# Altium schematic sheet 12_Power.SchDoc: Power
size A3; Organization: Lime Microsystems; Address1: Surrey Tech Centre; Address2: Guildford GU2 7YG; Address3: Surrey; Address4: United Kingdom; Revision: v1.0; SheetNumber: 12; SheetTotal: 12
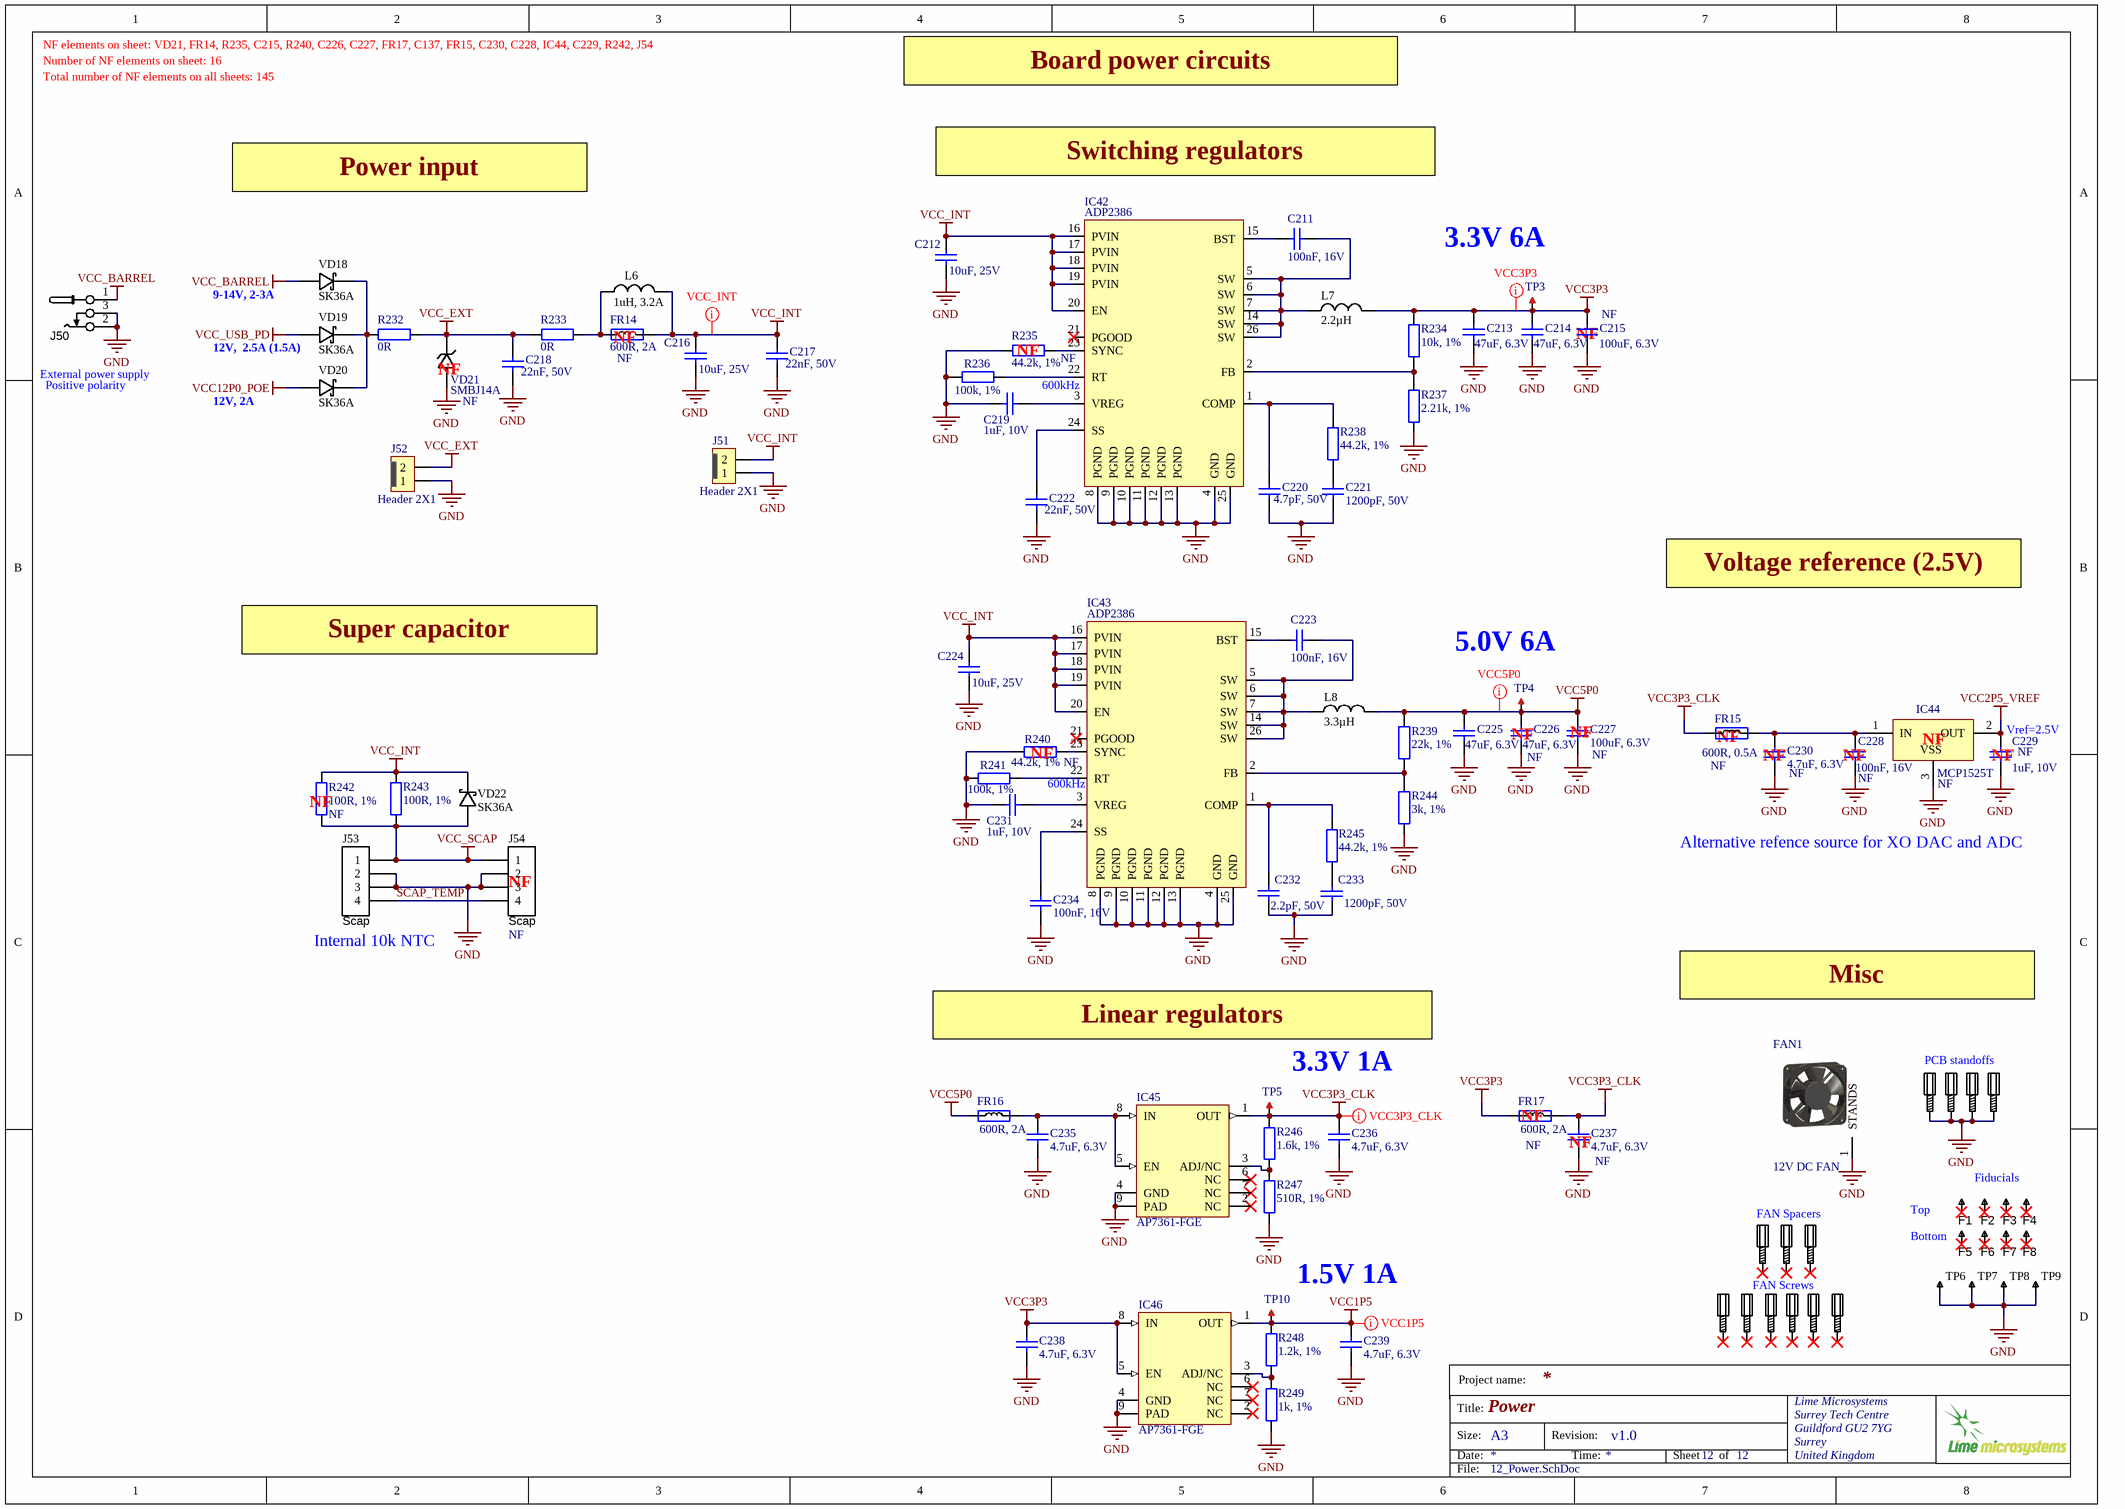
[diagram p0: 12_Power.SchDoc]

## Parts
C211  100nF, 16V  [CAP0402]
C212  10uF, 25V  [CAP0805]
C213  47uF, 6.3V  [CAP1206]
C214  47uF, 6.3V  [CAP1206]
C215  100uF, 6.3V  Assembly Info: NF  [CAP1206]
C216  10uF, 25V  [CAP0805]
C217  22nF, 50V  [CAP0402]
C218  22nF, 50V  [CAP0402]
C219  1uF, 10V  [CAP0402]
C220  4.7pF, 50V  [CAP0402]
C221  1200pF, 50V  [CAP0402]
C222  22nF, 50V  [CAP0402]
C223  100nF, 16V  [CAP0402]
C224  10uF, 25V  [CAP0805]
C225  47uF, 6.3V  [CAP1206]
C226  47uF, 6.3V  Assembly Info: NF  [CAP1206]
C227  100uF, 6.3V  Assembly Info: NF  [CAP1206]
C228  100nF, 16V  Assembly Info: NF  [CAP0402]
C229  1uF, 10V  Assembly Info: NF  [CAP0402]
C230  4.7uF, 6.3V  Assembly Info: NF  [CAP0402]
C231  1uF, 10V  [CAP0402]
C232  2.2pF, 50V  [CAP0402]
C233  1200pF, 50V  [CAP0402]
C234  100nF, 16V  [CAP0402]
C235  4.7uF, 6.3V  [CAP0402]
C236  4.7uF, 6.3V  [CAP0402]
C237  4.7uF, 6.3V  Assembly Info: NF  [CAP0402]
C238  4.7uF, 6.3V  [CAP0402]
C239  4.7uF, 6.3V  [CAP0402]
F1  Fiducial  [Fiducial]  (value not drawn)
F2  Fiducial  [Fiducial]  (value not drawn)
F3  Fiducial  [Fiducial]  (value not drawn)
F4  Fiducial  [Fiducial]  (value not drawn)
F5  Fiducial  [Fiducial]  (value not drawn)
F6  Fiducial  [Fiducial]  (value not drawn)
F7  Fiducial  [Fiducial]  (value not drawn)
F8  Fiducial  [Fiducial]  (value not drawn)
FAN1  12V DC FAN  [FAN_80mm_V1]
FR14  600R, 2A  Assembly Info: NF  [RES0805]
FR15  600R, 0.5A  Assembly Info: NF  [RES0402]
FR16  600R, 2A  [RES0805]
FR17  600R, 2A  Assembly Info: NF  [RES0805]
IC42  ADP2386  [ADP2386]
IC43  ADP2386  [ADP2386]
IC44  MCP1525T  Assembly Info: NF  [SOT23-3_v2]
IC45  AP7361-FGE  [AP7361]
IC46  AP7361-FGE  [AP7361]
J50  CONN_PWR_JACK_2.1x5.5mm  [CONN_PWR_JACK_v2]  (value not drawn)
J51  Header 2X1  [Header1x2_TH_LOCKING]
J52  Header 2X1  [Header1x2_TH_LOCKING]
J53  Scap  [874370443_1P5_SMD_HEADER]
J54  Scap  Assembly Info: NF  [HEADER4X1_TH]
L6  1uH, 3.2A  [NRS4018T3R3MDGJ_inductor]
L7  2.2µH  [FDVE1040_TOKO_INDUCTOR]
L8  3.3µH  [FDVE1040_TOKO_INDUCTOR]
MECH15  # pcs.  [PCB_standoff]  (value not drawn)
MECH16  # pcs.  [PCB_standoff]  (value not drawn)
MECH17  # pcs.  [PCB_standoff]  (value not drawn)
MECH18  # pcs.  [PCB_standoff]  (value not drawn)
MECH19  Spacer M3  (value not drawn)  (mechanical)
MECH20  Spacer M3  (value not drawn)  (mechanical)
MECH21  Spacer M3  (value not drawn)  (mechanical)
MECH22  Screws M3  (value not drawn)  (mechanical)
MECH23  Screws M3  (value not drawn)  (mechanical)
MECH24  Screws M3  (value not drawn)  (mechanical)
MECH25  Screws M3  (value not drawn)  (mechanical)
MECH26  Screws M3  (value not drawn)  (mechanical)
MECH27  Screws M3  (value not drawn)  (mechanical)
R232  0R  [RES0805]
R233  0R  [RES0805]
R234  10k, 1%  [RES0402]
R235  44.2k, 1%  Assembly Info: NF  [RES0402]
R236  100k, 1%  [RES0402]
R237  2.21k, 1%  [RES0402]
R238  44.2k, 1%  [RES0402]
R239  22k, 1%  [RES0402]
R240  44.2k, 1%  Assembly Info: NF  [RES0402]
R241  100k, 1%  [RES0402]
R242  100R, 1%  Assembly Info: NF  [RES0805]
R243  100R, 1%  [RES0805]
R244  3k, 1%  [RES0402]
R245  44.2k, 1%  [RES0402]
R246  1.6k, 1%  [RES0402]
R247  510R, 1%  [RES0402]
R248  1.2k, 1%  [RES0402]
R249  1k, 1%  [RES0402]
TP3  TESTPOINT_PAD  [TP_PAD_1p5MM]  (value not drawn)  (no BOM)
TP4  TESTPOINT_PAD  [TP_PAD_1p5MM]  (value not drawn)  (no BOM)
TP5  TESTPOINT_PAD  [TP_PAD_1p5MM]  (value not drawn)  (no BOM)
TP6  TESTPOINT_THT_MINI  [TP-SMD-LOW_PROFILE]  (value not drawn)
TP7  TESTPOINT_THT_MINI  [TP-SMD-LOW_PROFILE]  (value not drawn)
TP8  TESTPOINT_THT_MINI  [TP-SMD-LOW_PROFILE]  (value not drawn)
TP9  TESTPOINT_THT_MINI  [TP-SMD-LOW_PROFILE]  (value not drawn)
TP10  TESTPOINT_PAD  [TP_PAD_1p5MM]  (value not drawn)  (no BOM)
VD18  SK36A  [SK32A-L_DIODE_DO-214AC]
VD19  SK36A  [SK32A-L_DIODE_DO-214AC]
VD20  SK36A  [SK32A-L_DIODE_DO-214AC]
VD21  SMBJ14A  Assembly Info: NF  [SMAJ12CA-13-F]
VD22  SK36A  [SK32A-L_DIODE_DO-214AC]

## Nets
GND: C212.1 C213.1 C214.1 C215.1 C216.1 C217.2 C218.2 C219.2 C220.2 C221.2 C222.2 C224.1 C225.1 C226.1 C227.1 C228.2 C229.1 C230.1 C231.2 C232.2 C233.2 C234.1 C235.1 C236.1 C237.1 C238.1 C239.1 FAN1.1(STANDS) IC42.4(GND) IC42.8(PGND) IC42.9(PGND) IC42.10(PGND) IC42.11(PGND) IC42.12(PGND) IC42.13(PGND) IC42.25(GND) IC43.4(GND) IC43.8(PGND) IC43.9(PGND) IC43.10(PGND) IC43.11(PGND) IC43.12(PGND) IC43.13(PGND) IC43.25(GND) IC44.3(VSS) IC45.4(GND) IC45.9(PAD) IC46.4(GND) IC46.9(PAD) J50.2 J50.3 J51.1 J52.1 J53.2 J53.3 J54.2 J54.3 MECH15.MH1 MECH16.MH1 MECH17.MH1 MECH18.MH1 R235.2 R236.2 R237.1 R240.2 R241.2 R244.1 R247.2 R249.1 TP6.1 TP7.1 TP8.1 TP9.1 VD21.A
VCC1P5: C239.2 IC46.1(OUT) R248.1 TP10.1
VCC2P5_VREF: C229.2 IC44.2(OUT)
VCC3P3: C213.2 C214.2 C215.2 C238.2 FR17.1 IC46.5(EN) IC46.8(IN) L7.2 R234.1 TP3.1
VCC3P3_CLK: C236.2 C237.2 FR15.1 FR17.2 IC45.1(OUT) R246.2 TP5.1
VCC5P0: C225.2 C226.2 C227.2 FR16.1 L8.2 R239.2 TP4.1
VCC12P0_POE: VD20.A
VCC_BARREL: J50.1 VD18.A
VCC_EXT: C218.1 J52.2 R232.1 R233.2 VD21.K
VCC_INT: C212.2 C216.2 C217.1 C224.2 FR14.2 IC42.16(PVIN) IC42.17(PVIN) IC42.18(PVIN) IC42.19(PVIN) IC42.20(EN) IC43.16(PVIN) IC43.17(PVIN) IC43.18(PVIN) IC43.19(PVIN) IC43.20(EN) J51.2 L6.2 R242.1 R243.1 VD22.K
VCC_SCAP: J53.1 J54.1 R242.2 R243.2 VD22.A
VCC_USB_PD: VD19.A
SCAP_TEMP: J53.4 J54.4
NetC211_1: C211.1 IC42.15(BST)
NetC211_2: C211.2 IC42.5(SW) IC42.6(SW) IC42.7(SW) IC42.14(SW) IC42.26(SW) L7.1
NetC219_1: C219.1 IC42.3(VREG)
NetC220_1: C220.1 IC42.1(COMP) R238.2
NetC221_1: C221.1 R238.1
NetC222_1: C222.1 IC42.24(SS)
NetC223_1: C223.1 IC43.15(BST)
NetC223_2: C223.2 IC43.5(SW) IC43.6(SW) IC43.7(SW) IC43.14(SW) IC43.26(SW) L8.1
NetC228_1: C228.1 C230.2 FR15.2 IC44.1(IN)
NetC231_1: C231.1 IC43.3(VREG)
NetC232_1: C232.1 IC43.1(COMP) R245.2
NetC233_1: C233.1 R245.1
NetC234_2: C234.2 IC43.24(SS)
NetC235_2: C235.2 FR16.2 IC45.5(EN) IC45.8(IN)
NetFR14_1: FR14.1 L6.1 R233.1
NetIC42_2: IC42.2(FB) R234.2 R237.2
NetIC42_22: IC42.22(RT) R236.1
NetIC42_23: IC42.23(SYNC) R235.1
NetIC43_2: IC43.2(FB) R239.1 R244.2
NetIC43_22: IC43.22(RT) R241.1
NetIC43_23: IC43.23(SYNC) R240.1
NetIC45_3: IC45.3(ADJ/NC) R246.1 R247.1
NetIC46_3: IC46.3(ADJ/NC) R248.2 R249.2
NetR232_2: R232.2 VD18.K VD19.K VD20.K

Not connected (* = marked no-connect by the designer): F1 1*; F2 1*; F3 1*; F4 1*; F5 1*; F6 1*; F7 1*; F8 1*; IC42 21(PGOOD)*; IC43 21(PGOOD)*; IC45 2(NC)* 6(NC)* 7(NC)*; IC46 2(NC)* 6(NC)* 7(NC)*; MECH19 MH1*; MECH20 MH1*; MECH21 MH1*; MECH22 MH1*; MECH23 MH1*; MECH24 MH1*; MECH25 MH1*; MECH26 MH1*; MECH27 MH1*

## Layout directives
net class VCC1P4_LMS: VCC1P5
net class VCC3P3_CLK: VCC3P3_CLK
net class VCC3P3: VCC3P3
net class VCC_INT: VCC_INT
net class VCC5P0: VCC5P0

## Notes on the sheet
- NF elements on sheet: VD21, FR14, R235, C215, R240, C226, C227, FR17, C137, FR15, C230, C228, IC44, C229, R242, J54
- Number of NF elements on sheet: 16
- Total number of NF elements on all sheets: 145
- Board power circuits
- Switching regulators
- Power input
- (near TP3) 3.3V 6A
- 9-14V, 2-3A
- (near J50) External power supply
- (near VD19) 12V,  2.5A (1.5A)
- (near VD21) NF
- (near FR14) NF
- (near R235) NF
- (near C215) NF
- (near J50) Positive polarity
- 12V, 2A
- (near IC42) 600kHz
- Voltage reference (2.5V)
- Super capacitor
- (near TP4) 5.0V 6A
- (near R240) NF
- (near IC43) 600kHz
- (near C226) NF
- (near C227) NF
- (near FR15) NF
- (near C230) NF
- (near C228) NF
- (near IC44) NF
- (near C229) NF
- (near C229) Vref=2.5V
- (near R242) NF
- Alternative refence source for XO DAC and ADC
- (near J54) NF
- (near J53) Internal 10k NTC
- Linear regulators
- Misc
- 3.3V 1A
- (near FR17) NF
- PCB standoffs
- (near C237) NF
- Fiducials
- FAN Spacers
- Top
- (near F5) Bottom
- 1.5V 1A
- FAN Screws
- Project name:
- Title:
- Size:
- Date:
- A3
- Revision:
- Time:
- Sheet
- of
- File:

## Library data of the parts
C211 C223 C234 = Cap_0402: Manufacturer: Murata Electronics; Manufacturer Part Number 1: GRM155R71C104KA88D; Part Description: 0.10µF ±10% 16V Ceramic Capacitor X7R 0402 (1005 Metric); Tolerance: 10 %; Type: General Purpose MLCC; Capacitance: 0.1 uF; Case Length: 1 mm; Dielectric: X7R; Case Height: 0.5 mm; Temperature Coefficient / Code: +/- 15 %; Value: 100nF, 16V; Supplier 1: Mouser; Supplier Part Number 1: 81-GRM155R71C104KA88; Case Code - in: 0402; RoHS: RoHS Compliant; Operating Temperature Range: - 55 C to + 125 C; Series: GRM; Termination Style: SMD/SMT; Package / Case: 0402 (1005 metric); Voltage Rating DC: 16 V; Maximum Operating Temperature: + 125 C; Case Code - mm: 1005; Minimum Operating Temperature: - 55 C; Product Category: Low & Medium Capacitance SMD Ceramic Chip Capacitors; Packaging: Reel; Product: General Type MLCCs; Category: Multilayer Ceramic Capacitors MLCC - SMD/SMT; Brand: Murata Electronics; Case Width: 0.5 mm; RoHS - Mouser: Y; Standard Pack Qty: 10000; Minimum Order Quantity: 1; Reeling: True; Manufacturer Part Number: GRM155R71C104KA88D
C212 C216 C224 = Cap_0603: Manufacturer: Murata Electronics North America; Manufacturer Part Number: GRM188R61E106MA73D; Part Description: 10µF ±20% 25V X5R Ceramic Capacitor -55°C ~ 85°C Surface Mount, MLCC 0603 (1608 Metric) 0.063" L x 0.031" W (1.60mm x 0.80mm); Capacitance: 10µF; Tolerance: ±20%; Temperature Coefficient: X5R; Supplier 1: Digi-Key; Supplier Part Number 1: 490-7202-2-ND; Category: Capacitors; RoHS: RoHS Compliant; Packaging: Tape & Reel (TR); Voltage - Rated: 25V; Mounting Type: Surface Mount, MLCC; Operating Temperature: -55°C ~ 85°C; Applications: General Purpose; Ratings: -; Package / Case: 0603 (1608 Metric); Size / Dimension: 0.063" L x 0.031" W (1.60mm x 0.80mm); Height - Seated (Max): -; Thickness (Max): 0.031" (0.80mm); Lead Spacing: -; Features: -; Lead Style: -; value: 10uF, 25V; Manufacturer Part Number 1: GRM188R61E106MA73D
C213 C214 C225 C226 = Cap_1206: Manufacturer: Samsung Electro-Mechanics; Manufacturer Part Number: CL31A476MQHNNNE; Part Description: 47µF ±20% 6.3V Ceramic Capacitor X5R 1206 (3216 Metric); Notification: Current market demand for these product types have resulted in fluctuating and extending lead times. Lead times may differ.; Temperature Coefficient: X5R; Tolerance: ±20%; Thickness (Max): 0.071" (1.80mm); Height - Seated (Max): -; Operating Temperature: -55°C ~ 85°C; Lead Style: -; Package / Case: 1206 (3216 Metric); Size / Dimension: 0.126" L x 0.063" W (3.20mm x 1.60mm); Applications: General Purpose; Ratings: -; Mounting Type: Surface Mount, MLCC; Voltage - Rated: 6.3V; Lead Spacing: -; Features: -; Supplier Part Number 1: 1276-1167-1-ND; RoHS: RoHS Compliant; Category: Capacitors; Supplier 1: Digi-Key; Packaging: Cut Tape (CT); Part Status: Active; Value: 47uF, 6.3V; Manufacturer Part Number 1: CL31A476MQHNNNE
C215 C227 = Cap_1206: Manufacturer: MURATA; Manufacturer Part Number 1: GRM31CR60J107ME39L.; Part Description: SMD Multilayer Ceramic Capacitor, 1206 [3216 Metric], 100 µF, 6.3 V, ± 20%, X5R, GRM Series; Capacitance Tolerance: ± 20%; Ceramic Capacitor Case: 1206 [3216 Metric]; Voltage Rating: 6.3; value: 100uF, 6.3V; Supplier Part Number 1: 1735535; Supplier 1: Farnell
C217 C218 C222 = Cap_0402: Manufacturer: Kemet; Manufacturer Part Number 1: C0402C223K5RACTU; Part Description: 0.022µF ±10% 50V X7R Ceramic Capacitor -55°C ~ 125°C Surface Mount, MLCC 0402 (1005 Metric) 0.039" L x 0.020" W (1.00mm x 0.50mm); Temperature Coefficient: X7R; Tolerance: ±10%; Capacitance: 0.022µF; Value: 22nF, 50V; Supplier 1: Digi-Key; Supplier Part Number 1: 399-7780-1-ND; Ratings: -; Packaging: Cut Tape (CT); Category: Capacitors; Size / Dimension: 0.039" L x 0.020" W (1.00mm x 0.50mm); RoHS: RoHS Compliant; Operating Temperature: -55°C ~ 125°C; Mounting Type: Surface Mount, MLCC; Applications: General Purpose; Voltage - Rated: 50V; Thickness (Max): 0.022" (0.55mm); Features: -; Height - Seated (Max): -; Lead Style: -; Package / Case: 0402 (1005 Metric); Lead Spacing: -
C219 C229 C231 = Cap_0402: Manufacturer Part Number 1: CC0402MRX5R6BB105; Manufacturer: Yageo; Part Description: 1µF 10V Ceramic Capacitor X5R 0402 (1005 Metric) 0.039" L x 0.020" W (1.00mm x 0.50mm); Voltage Rating: 10; Capacitance Tolerance: ± 10%; Product Range: TDK - C Series; Ceramic Capacitor Case: 0402 [1005 Metric]; Capacitance: 1; Dielectric Characteristic: X6; Value: 1uF, 10V; Supplier 1: Digi-Key; Supplier Part Number 1: 311-1732-1-ND; MSL: -; RoHS: YES
C220 = Cap_0402: Manufacturer Part Number 1: GRM1555C1H4R7CA01D; Part Description: 4.7pF ±0.25pF 50V C0G, NP0 Ceramic Capacitor -55°C ~ 125°C Surface Mount, MLCC 0402 (1005 Metric) 0.039" L x 0.020" W (1.00mm x 0.50mm); Manufacturer: Murata Electronics North America; Capacitance Tolerance: ± 0.25; Voltage Rating: 50; Dielectric Characteristic: C0G / NP0; Ceramic Capacitor Case: 0402 [1005 Metric]; Capacitance: 4.7; SVHC: No SVHC (15-Jun-2015; Product Range: GRM Series; Value: 4.7pF, 50V; Supplier 1: Farnell; Supplier Part Number 1: 2434644; Operating Temperature Max: 125; Operating Temperature Min: -55; MSL: MSL 1 - Unlimited; RoHS: YES; Packaging: Cut Tape
C221 = Cap_0402: Manufacturer: Kemet; Manufacturer Part Number 1: C0402C122J5GACTU; Part Description: 1200pF ±5% 50V C0G, NP0 Ceramic Capacitor -55°C ~ 125°C Surface Mount, MLCC 0402 (1005 Metric) 0.039" L x 0.020" W (1.00mm x 0.50mm); Temperature Coefficient: C0G, NP0; Tolerance: ±5%; Value: 1200pF, 50V; Supplier 1: Digi-Key; Supplier Part Number 1: 399-7334-1-ND; Thickness (Max): 0.022" (0.55mm); Capacitance: 1200pF; Lead Spacing: -; Mounting Type: Surface Mount, MLCC; Package / Case: 0402 (1005 Metric); Category: Capacitors; Size / Dimension: 0.039" L x 0.020" W (1.00mm x 0.50mm); Voltage - Rated: 50V; Lead Style: -; Ratings: -; Features: -; Packaging: Cut Tape (CT); RoHS: RoHS Compliant; Operating Temperature: -55°C ~ 125°C; Applications: General Purpose; Height - Seated (Max): -
C228 = Cap_0603: Manufacturer Part Number 1: GRM155R71C104KA88D; Part Description: 0.10µF ±10% 16V Ceramic Capacitor X7R 0402 (1005 Metric); Brand: Murata Electronics; Tolerance: 10 %; Type: General Purpose MLCC; Capacitance: 0.1 uF; Temperature Coefficient / Code: +/- 15 %; Case Height: 0.5 mm; Case Length: 1 mm; Dielectric: X7R; Supplier 1: Mouser; Supplier Part Number 1: 81-GRM155R71C104KA88; Case Code - in: 0402; Manufacturer: Murata Electronics; Category: Multilayer Ceramic Capacitors MLCC - SMD/SMT; Voltage Rating DC: 16 V; Value: 100nF, 16V; Case Code - mm: 1005; Case Width: 0.5 mm; Maximum Operating Temperature: + 125 C; Minimum Operating Temperature: - 55 C; Minimum Order Quantity: 1; Operating Temperature Range: - 55 C to + 125 C; Package / Case: 0402 (1005 metric); Packaging: Reel; Product: General Type MLCCs; Product Category: Low & Medium Capacitance SMD Ceramic Chip Capacitors; Reeling: True; RoHS - Mouser: Y; RoHS: RoHS Compliant; Series: GRM; Standard Pack Qty: 10000; Termination Style: SMD/SMT; Manufacturer Part Number: GRM155R71C104KA88D
C230 C235-C239 = Cap_0402: Manufacturer: Murata Electronics North America; Manufacturer Part Number 1: GRM155R60J475ME87D; Part Description: 4.7µF ±20% 6.3V X5R Ceramic Capacitor -55°C ~ 85°C Surface Mount, MLCC 0402 (1005 Metric) 0.039" L x 0.020" W (1.00mm x 0.50mm); Tolerance: ±20%; Capacitance: 4.7µF; Temperature Coefficient: X5R; Lead Style: -; Ratings: -; Height - Seated (Max): -; Thickness (Max): 0.022" (0.55mm); Voltage - Rated: 6.3V; Packaging: Cut Tape (CT); Lead Spacing: -; Category: Capacitors; Supplier Part Number 1: 490-5408-1-ND; Applications: General Purpose; Operating Temperature: -55°C ~ 85°C; Mounting Type: Surface Mount, MLCC; Features: Derating Recommended; RoHS: RoHS Compliant; Supplier 1: Digi-Key; Package / Case: 0402 (1005 Metric); Size / Dimension: 0.039" L x 0.020" W (1.00mm x 0.50mm); Value: 4.7uF, 6.3V
C232 = Cap_0402: Manufacturer Part Number 1: CL05C2R2CB5NNNC; Manufacturer: Samsung Electro-Mechanics America, Inc.; Part Description: 2.2pF ±0.25pF 50V Ceramic Capacitor C0G, NP0 0402 (1005 Metric); Temperature Coefficient: C0G, NP0; Tolerance: ±0.25pF; Value: 2.2pF, 50V; Lead Spacing: -; Applications: General Purpose; Supplier 1: Digi-Key; Thickness (Max): 0.022" (0.55mm); Operating Temperature: -55°C ~ 125°C; Size / Dimension: 0.039" L x 0.020" W (1.00mm x 0.50mm); Mounting Type: Surface Mount, MLCC; Features: -; Voltage - Rated: 50V; Capacitance: 2.2pF; Lead Style: -; Supplier Part Number 1: 1276-1271-1-ND; Height - Seated (Max): -; Package / Case: 0402 (1005 Metric); Category: Capacitors; Packaging: Cut Tape (CT); Ratings: -; RoHS: RoHS Compliant
C233 = Cap_0402: Manufacturer: Kemet; Manufacturer Part Number 1: C0402C122J5GACTU; Part Description: 1200pF ±5% 50V Ceramic Capacitor C0G, NP0 0402 (1005 Metric); Temperature Coefficient: C0G, NP0; Tolerance: ±5%; Value: 1200pF, 50V; Supplier 1: Digi-Key; Supplier Part Number 1: 399-7334-1-ND; Thickness (Max): 0.022" (0.55mm); Capacitance: 1200pF; Lead Spacing: -; Mounting Type: Surface Mount, MLCC; Package / Case: 0402 (1005 Metric); Category: Capacitors; Size / Dimension: 0.039" L x 0.020" W (1.00mm x 0.50mm); Voltage - Rated: 50V; Lead Style: -; Ratings: -; Features: -; Packaging: Cut Tape (CT); RoHS: RoHS Compliant; Operating Temperature: -55°C ~ 125°C; Applications: General Purpose; Height - Seated (Max): -
FAN1 = 12V_DC_FAN: Part Description: Fan Tubeaxial 12VDC Square - 80mm L x 80mm H Vapo-Bearing™ 37.0 CFM (1.04m³/min) 2 Wire Leads; Manufacturer: Sunon; Manufacturer Part Number 1: ME80151V1-000U-A99; Airflow: 37CFM; Noise: 34.7dBA; Max Power Dissipation: 1.96W; RPM: 3000RPM; Bearing Type: Vapo-Bearing; Current Rating: 163mA; Approvals: UL,CE,TUV; Supplier 1: Digi-Key; Supplier Part Number 1: 259-1649-ND; Stock 1: 1611; Pricing 1: 1=6,90000, 10=6,66700, 25=6,47400, 50=6,08860, 100=5,47200, 250=5,39488, 500=5,04808 (USD); RoHS: Yes; Case/Package: Axial; Housing Material: Thermoplastic; Weight: 0.15lb; Min Operating Temperature: 14°C; Max Operating Temperature: 158°C; Termination: 2 Wire Leads; Package Quantity: 30; Width: 15mm; Flammability Rating: UL94 V-0; ComponentLink1URL: https://datasheet.ciiva.com/18514/me8015-u-18514537.pdf?src-supplier=Digi-Key; ComponentLink1Description: https://datasheet.ciiva.com/18514/me8015-u-18514537.pdf?src-supplier=Digi-Key
FR14 = Ferrite: Manufacturer Part Number 1: MPZ2012S601AT000; Manufacturer: TDK Corporation; Part Description: FERRITE BEAD 600 OHM 0805 1LN; DC Resistance (DCR): 100 mOhm Max; Filter Type: Differential Mode - Single; Impedance @ Frequency: 600 Ohm @ 100MHz; Supplier 1: Digi-Key; Supplier Part Number 1: 445-2206-2-ND; Value: 600R, 2A; Category: Filters; Current Rating: 2A; Height (Max): 0.041" (1.05mm); Mounting Type: Surface Mount; Package / Case: 0805 (2012 Metric); Packaging: Tape & Reel (TR); RoHS: RoHS Compliant; Size / Dimension: 0.079" L x 0.049" W (2.00mm x 1.25mm)
FR15 = Ferrite: Manufacturer: Murata; Manufacturer Part Number 1: BLM15AX601SN1D; Part Description: - Ferrite Bead 0402 (1005 Metric) 500mA 340mOhm; Tolerance: 25%; Current Rating: 500mA; Number of Lines: 1; DC Resistance (DCR): 340mR; Test Frequency: 100MHz; Value: 600R, 0.5A; Supplier 1: Digi-Key; Supplier Part Number 1: 490-5441-1-ND; Stock 1: 416370; Pricing 1: 1=0.1, 10=0.06, 25=0.0552, 50=0.0496, 100=0.0363, 250=0.0264, 500=0.0242, 1000=0.0209, 5000=0.0165 (USD); Case/Package: 0402; Number of Pins: 2; Case Code (Metric): 1005; Case Code (Imperial): 0402; Core Material: Ferrite; Material: Steel,Ferrite; Min Operating Temperature: -55°C; Max Operating Temperature: 125°C; Package Quantity: 1; Packaging: Tape and Reel; Series: BLM15AX_SN; Impedance: 600R; Max Current Rating: 500mA; Termination: SMD/SMT; Max DC Current: 500mA; Number of Circuits: 1; DC Resistance-Max: 340mR; Length: 1mm; Width: 0.5mm; Height: 0.5mm; Depth: 0.5mm; REACH SVHC: No SVHC; Lead Free: Lead Free; RoHS Compliant: Yes; ComponentLink1URL: https://www.murata.com/en-us/products/productdata/8796740059166/ENFA0018.pdf?src-supplier=Digi-Key; ComponentLink1Description: https://www.murata.com/en-us/products/productdata/8796740059166/ENFA0018.pdf?src-supplier=Digi-Key; ComponentLink2URL: http://search.murata.co.jp/Ceramy/image/img/PDF/ENG/L0110S0100BLM15AX_SN.pdf?src-supplier=Future+Electronics; ComponentLink2Description: http://search.murata.co.jp/Ceramy/image/img/PDF/ENG/L0110S0100BLM15AX_SN.pdf?src-supplier=Future+Electronics; ComponentLink3URL: http://www.produktinfo.conrad.com/datenblaetter/1100000-1199999/001171675-da-01-en-CHIP_DROSSEL0402_600R_420MA_1_0X0_5MM.pdf?src-supplier=Conrad; ComponentLink3Description: http://www.produktinfo.conrad.com/datenblaetter/1100000-1199999/001171675-da-01-en-CHIP_DROSSEL0402_600R_420MA_1_0X0_5MM.pdf?src-supplier=Conrad; ComponentLink4URL: http://www.produktinfo.conrad.com/datenblaetter/1100000-1199999/001172169-da-01-en-DROSSEL_0402_600R_1_0X0_5MM_10000ST.pdf?src-supplier=Conrad; ComponentLink4Description: http://www.produktinfo.conrad.com/datenblaetter/1100000-1199999/001172169-da-01-en-DROSSEL_0402_600R_1_0X0_5MM_10000ST.pdf?src-supplier=Conrad
FR16 FR17 = Ferrite: Manufacturer Part Number 1: MPZ2012S601AT000; Manufacturer: TDK Corporation; Part Description: FERRITE BEAD 600 OHM 0805 1LN; Filter Type: Differential Mode - Single; Impedance @ Frequency: 600 Ohm @ 100MHz; DC Resistance (DCR): 100 mOhm Max; Supplier 1: Digi-Key; Supplier Part Number 1: 445-2206-2-ND; Mounting Type: Surface Mount; RoHS: RoHS Compliant; Height (Max): 0.041" (1.05mm); Packaging: Tape & Reel (TR); Category: Filters; Current Rating: 2A; Package / Case: 0805 (2012 Metric); Size / Dimension: 0.079" L x 0.049" W (2.00mm x 1.25mm)
IC42 = ADP2386: Manufacturer Part Number: ADP2386ACPZN-R7; Manufacturer: Analog Devices Inc.; Part Description: IC REG BUCK ADJ 6A SYNC 24LFCSP; Function: Step-Down; Voltage - Output (Max): 18V; Synchronous Rectifier: Yes; Output Configuration: Positive; Frequency - Switching: 200kHz ~ 1.4MHz; Number of Outputs: 1; Output Type: Adjustable; Topology: Buck; Voltage - Input (Min): 4.5V; Voltage - Output (Min/Fixed): 0.6V; Voltage - Input (Max): 20V; Current - Output: 6A; Supplier 1: Digi-Key; Packaging: Digi-Reel®; RoHS: RoHS Compliant; Package / Case: 24-WFQFN Exposed Pad, CSP; Operating Temperature: -40°C ~ 125°C (TJ); Supplier Device Package 1: 24-LFCSP-WQ (4x4); Mounting Type: Surface Mount; Category: Integrated Circuits (ICs); Supplier Part Number 1: ADP2386ACPZN-R7DKR-ND; Manufacturer Part Number 1: ADP2386ACPZN-R7
IC43 = ADP2386: Manufacturer: Analog Devices Inc.; Part Description: Buck Switching Regulator IC Positive Adjustable 0.6V 1 Output 6A 24-WFQFN Exposed Pad, CSP; Manufacturer Part Number 1: ADP2386ACPZN-R7; Function: Step-Down; Voltage - Output (Max): 18V; Synchronous Rectifier: Yes; Output Configuration: Positive; Frequency - Switching: 200kHz ~ 1.4MHz; Number of Outputs: 1; Output Type: Adjustable; Topology: Buck; Voltage - Input (Min): 4.5V; Voltage - Output (Min/Fixed): 0.6V; Voltage - Input (Max): 20V; Current - Output: 6A; Supplier 1: Digi-Key; Packaging: Digi-Reel®; RoHS: RoHS Compliant; Package / Case: 24-WFQFN Exposed Pad, CSP; Operating Temperature: -40°C ~ 125°C (TJ); Supplier Device Package: 24-LFCSP-WQ (4x4); Mounting Type: Surface Mount; Category: Integrated Circuits (ICs); Supplier Part Number 1: ADP2386ACPZN-R7DKR-ND
IC44 = MCP1525T-I/TT: 2.5V Voltage Reference, 3-Pin SOT-23, Industrial Temperature, Tape and Reel; Manufacturer: Microchip Technology; Part Description: Series Voltage Reference IC ±1% 2mA SOT-23-3; Reference Type: Series; Output Type: Fixed; Current - Output: 2mA; Tolerance: ±1%; Temperature Coefficient: 50ppm/°C; Noise - 0.1Hz to 10Hz: 90µVp-p; Noise - 10Hz to 10kHz: 500µVrms; Voltage - Input: 2.7 V ~ 5.5 V; Current - Supply: 120µA; PackageDescription: Series Voltage Reference IC ±1% 2mA SOT-23-3; Supplier 1: Digi-Key; Manufacturer Part Number 1: MCP1525T-I/TT; RoHS: RoHS Compliant; Category: Integrated Circuits (ICs); Stock 1: 16612; Pricing 1: 1=0.77, 25=0.64, 100=0.58 (USD); Packaging: Digi-Reel®; Part Status: Active; Voltage - Output (Min/Fixed): 2.5V; Voltage - Output (Max): -; Current - Cathode: -; Operating Temperature: -40°C ~ 85°C (TA); Mounting Type: Surface Mount; Package / Case: TO-236-3, SC-59, SOT-23-3; Supplier Device Package: SOT-23-3; ComponentLink1URL: http://www.microchip.com/mymicrochip/filehandler.aspx?ddocname=en011331; ComponentLink1Description: http://www.microchip.com/mymicrochip/filehandler.aspx?ddocname=en011331; Supplier Part Number 1: MCP1525T-I/TTDKR-ND
IC45 IC46 = AP7361: Manufacturer Part Number 1: AP7361-FGE-7; Manufacturer: Diodes Incorporated; Part Description: IC REG LDO ADJ 1A 8DFN; Regulator Topology: Positive Adjustable; Current - Output: 1A; Current - Limit (Min): 1.1A; Voltage - Dropout (Typical): 0.5V @ 1A; Voltage - Output: 0.8 V ~ 5.5 V; Number of Regulators: 1; Voltage - Input: 2.2 V ~ 6 V; Supplier 1: Digi-Key; Supplier Part Number 1: AP7361-FGE-7DICT-ND; RoHS: RoHS Compliant; Supplier Device Package: U-DFN3030-8; Mounting Type: Surface Mount; Category: Integrated Circuits (ICs); Packaging: Cut Tape (CT); Package / Case: 8-UDFN Exposed Pad; Operating Temperature: -40°C ~ 85°C
J50 = CONN_PWR_JACK_2.1x5.5mm: Power Connector, THT, 2.1mm ID, 5.5mm OD; Part Description: Power Barrel Connector Jack 2.10mm ID (0.083"), 5.50mm OD (0.217") Through Hole, Right Angle; Manufacturer: CUI; Manufacturer Part Number 1: PJ-002A; Gender: Male; Shielding: Unshielded; Current Rating: 2.5A; Connector Type: Jack; Voltage Rating: 24V; Insulation Resistance: 50MR; Number of Conductors: 2; ComponentLink1URL: https://www.verical.com/server-webapp/html/getDatasheet?partID=110865; ComponentLink1Description: https://www.verical.com/server-webapp/html/getDatasheet?partID=110865; ComponentLink2URL: http://www.switchcraft.com/Documents/Jack_Schematics.pdf; ComponentLink2Description: http://www.switchcraft.com/Documents/Jack_Schematics.pdf; Supplier 1: Digi-Key; Supplier Part Number 1: CP-002A-ND; RoHS: Yes; Stock 1: 181439; Pricing 1: 1 = 0,60000, 10 = 0,55800, 25 = 0,50240, 50 = 0,44640, 100 = 0,42780, 250 = 0,39060, 500 = 0,37200, 1000 = 0,30690, 2500 = 0,27900 (USD); Mount: Through Hole; Contact Material: Copper,Copper Alloy; Contact Plating: Nickel,Tin; Housing Color: Black; Housing Material: Thermoplastic; Color: Black; Min Operating Temperature: -25°C; Max Operating Temperature: 85°C; Termination: Through Hole; Packaging: Bulk; Package Quantity: 500; Contact Gender: Male; Orientation: Horizontal; Diameter: 2.1mm; Lead Free: Lead Free; Flammability Rating: UL94 V-0
J51 J52 = Header 2X1 LOCK: Manufacturer 1: Molex; Part Description: Connector Header Through Hole 2 position 0.100" (2.54mm); Supplier 1: Digi-Key; Supplier Part Number 1: WM19460-ND; Manufacturer Part Number: 22-11-2026; Stock 1: 0; RoHS: Yes; ComponentLink1URL: https://datasheet.ciiva.com/5156/022045042-sd-206842-5156139.pdf?src-supplier=Mouser; ComponentLink1Description: https://datasheet.ciiva.com/5156/022045042-sd-206842-5156139.pdf?src-supplier=Mouser; ComponentLink2URL: https://datasheet.ciiva.com/30212/022232051-sd-30212109.pdf?src-supplier=Onlinecomponents.com; ComponentLink2Description: https://datasheet.ciiva.com/30212/022232051-sd-30212109.pdf?src-supplier=Onlinecomponents.com; Manufacturer: Molex; Manufacturer Part Number 1: 22-11-2026
J53 = Header4P: Header, 4-pin; Manufacturer 1: Molex; Manufacturer Part Number: 0874370443; Part Description: Connector Header Surface Mount 4 position 0.059" (1.50mm); ComponentLink1URL: http://katalog.we-online.de/em/datasheet/6130xx11121.pdf; ComponentLink1Description: http://katalog.we-online.de/em/datasheet/6130xx11121.pdf; Supplier 1: Digi-Key; Supplier Part Number 1: WM7664CT-ND; Stock 1: 30818; Pricing 1: 1=0,72000, 10=0,61200, 100=0,47560 (USD); RoHS: Yes; ComponentLink2URL: https://datasheet.ciiva.com/6813/874370443-sd-6813714.pdf?src-supplier=Digi-Key; ComponentLink2Description: https://datasheet.ciiva.com/6813/874370443-sd-6813714.pdf?src-supplier=Digi-Key; ComponentLink3URL: https://datasheet.ciiva.com/3935/197970874370443-pcb-headers-3935892.pdf?src-supplier=Arrow+Electronics; ComponentLink3Description: https://datasheet.ciiva.com/3935/197970874370443-pcb-headers-3935892.pdf?src-supplier=Arrow+Electronics; ComponentLink4URL: https://datasheet.ciiva.com/6813/874370443-sd-6813717.pdf?src-supplier=Digi-Key; ComponentLink4Description: https://datasheet.ciiva.com/6813/874370443-sd-6813717.pdf?src-supplier=Digi-Key; ComponentLink5URL: https://datasheet.ciiva.com/6813/874370443-sd-6813721.pdf?src-supplier=Digi-Key; ComponentLink5Description: https://datasheet.ciiva.com/6813/874370443-sd-6813721.pdf?src-supplier=Digi-Key; Manufacturer: Molex; Manufacturer Part Number 1: 0874370443
J54 = Header4P: Header, 4-pin; Part Description: 4 Positions Header Connector 0.100" (2.54mm) Through Hole Gold; Manufacturer: Wurth Electronics Inc.; Manufacturer Part Number 1: 61300411121; Pitch - Mating: 0.100" (2.54mm); Number of Positions: 4; Number of Positions Loaded: All; Style: Board to Board or Cable; Shrouding: Unshrouded; Contact Length - Mating: 0.236" (6.00mm); Contact Length - Post: 0.118" (3.00mm); Overall Contact Length: 0.454" (11.54mm); Material Flammability Rating: UL94 V-0; Current Rating: 3A; Voltage Rating: 250V; Supplier 1: Digi-Key; Supplier Part Number 1: 732-5317-ND; RoHS: RoHS Compliant; Category: Connectors, Interconnects; Stock 1: 25204; Pricing 1: 1=0.18, 10=0.153, 25=0.1272, 50=0.106, 100=0.096, 1000=0.088 (USD); Packaging: Bulk; Part Status: Active; Connector Type: Header; Contact Type: Male Pin; Number of Rows: 1; Row Spacing - Mating: -; Mounting Type: Through Hole; Termination: Solder; Fastening Type: Push-Pull; Insulation Height: 0.100" (2.54mm); Contact Shape: Square; Contact Finish - Mating: Gold; Contact Finish Thickness - Mating: -; Contact Finish - Post: -; Contact Material: Copper Alloy; Insulation Material: Polybutylene Terephthalate (PBT); Features: -; Operating Temperature: -40°C ~ 125°C; Ingress Protection: -; Insulation Color: Black; Mated Stacking Heights: -; Contact Finish Thickness - Post: -; Applications: -; ComponentLink1URL: http://katalog.we-online.de/em/datasheet/6130xx11121.pdf; ComponentLink1Description: http://katalog.we-online.de/em/datasheet/6130xx11121.pdf
L6 = Inductor_0603: Manufacturer: Taiyo Yuden; Manufacturer Part Number 1: NRS4018T1R0NDGJ; Part Description: 1 µH Shielded Drum Core, Wirewound Inductor 3.2 A 32.4mOhm Max Nonstandard; Core Material: Ferrite; Self Resonant Frequency: 90MHz; Tolerance: 30%; Saturation Current: 4A; Shielding: Shielded; DC Resistance (DCR): 32.4mR; Test Frequency: 100kHz; ComponentLink1URL: https://www.yuden.co.jp/productdata/catalog/en/wound04_e.pdf; ComponentLink1Description: https://www.yuden.co.jp/productdata/catalog/en/wound04_e.pdf; ComponentLink2URL: http://uk.rs-online.com/webdocs/10b3/0900766b810b3cd2.pdf; ComponentLink2Description: http://uk.rs-online.com/webdocs/10b3/0900766b810b3cd2.pdf; Supplier 1: Digi-Key; Supplier Part Number 1: 587-2888-1-ND; Stock 1: 277625; Pricing 1: 1=0,27000, 10=0,23800, 25=0,20840, 50=0,17860, 100=0,16370, 250=0,14884, 500=0,13990, 1000=0,10716 (USD); RoHS: Yes; Mount: Surface Mount; Case/Package: Nonstandard; Number of Pins: 2; Min Operating Temperature: -25°C; Max Operating Temperature: 125°C; Packaging: Cut Tape; Inductance: 1uH; Package Quantity: 3500; Current Rating: 3.2A; Inductance Tolerance: 30%; Resistor Type: Wirewound; Max DC Current: 4A; Termination: SMD/SMT; RMS Current (Irms): 3.2A; Series: NRS; Length: 4mm; Width: 0.157inch; Height: 1.8mm; Height - Seated (Max): 0.071inch; Depth: 4.2mm; Lead Pitch: 2.8mm; Radiation Hardening: No; Lead Free: Lead Free; Halogen Free: Halogen Free; REACH SVHC: Unknown; RoHS Compliant: Yes; ComponentLink3URL: https://datasheet.ciiva.com/1043/nrs4018t1r0ndgj-ss-1043587.pdf?src-supplier=Digi-Key; ComponentLink3Description: https://datasheet.ciiva.com/1043/nrs4018t1r0ndgj-ss-1043587.pdf?src-supplier=Digi-Key; ComponentLink4URL: https://datasheet.ciiva.com/25607/0900766b810b3cd2-25607942.pdf?src-supplier=RSComponents; ComponentLink4Description: https://datasheet.ciiva.com/25607/0900766b810b3cd2-25607942.pdf?src-supplier=RSComponents; ComponentLink5URL: https://datasheet.ciiva.com/8504/nrs4018t1r0ndgj-ss-8504305.pdf?src-supplier=Avnet; ComponentLink5Description: https://datasheet.ciiva.com/8504/nrs4018t1r0ndgj-ss-8504305.pdf?src-supplier=Avnet; Value: 1uH, 3.2A
L7 = Inductor_0603: Manufacturer Part Number 1: IHLP4040DZER2R2M01; Manufacturer: Vishay Dale; Part Description: 2.2µH Shielded Molded Inductor 12A 9 mOhm Max Nonstandard; Type: Molded; Current Rating: 12A; Frequency - Test: 100kHz; Current - Saturation: 25.6A; DC Resistance (DCR): 9 mOhm Max; Shielding: Shielded; Tolerance: ±20%; Supplier 1: Digi-Key; Supplier Part Number 1: 541-1299-1-ND; Package / Case: Nonstandard; Material - Core: -; Size / Dimension: 0.430" L x 0.405" W (10.92mm x 10.30mm); Supplier Device Package: -; Inductance: 2.2µH; Frequency - Self Resonant: -; Packaging: Cut Tape (CT); Height - Seated (Max): 0.158" (4.00mm); Category: Inductors, Coils, Chokes; RoHS: RoHS Compliant; Mounting Type: Surface Mount; Operating Temperature: -55°C ~ 125°C; Q @ Freq: -; value: 2.2µH
L8 = Inductor_0603: Manufacturer: Vishay Dale; Manufacturer Part Number 1: IHLP4040DZER3R3M01; Part Description: 3.3µH Shielded Molded Inductor 10A 14.4 mOhm Max Nonstandard; DC Resistance (DCR): 14.4 mOhm Max; Shielding: Shielded; Type: Molded; Current Rating: 10A; Frequency - Test: 100kHz; Current - Saturation: 18.6A; Tolerance: ±20%; value: 3.3µH; Package / Case: Nonstandard; Q @ Freq: -; Supplier 1: Digi-Key; Packaging: Cut Tape (CT); Inductance: 3.3µH; Material - Core: -; Category: Inductors, Coils, Chokes; Frequency - Self Resonant: -; Height - Seated (Max): 0.158" (4.00mm); Supplier Device Package: -; RoHS: RoHS Compliant; Size / Dimension: 0.430" L x 0.405" W (10.92mm x 10.30mm); Mounting Type: Surface Mount; Operating Temperature: -55°C ~ 125°C; Supplier Part Number 1: 541-1298-1-ND
MECH15-MECH18 = STANDOFF_M-F_THREADED_M3x8x10mm_HEX_5mm dia: STANDOFF M/F MET 5MM HEX 10MM L; Manufacturer: FIX&FASTEN; Manufacturer Part Number 1: FIX-MAE-5TV; Part Description: PCB distance; polyamide; L:5mm; Colour: natural; Øcutout:3mm; Unit: pcs; SuppliedAmount: 1000; MinAmount: 10; Type of spacer: PCB distance; Panel cutout diameter: 3mm; Spanner size: 5.5mm; Internal thread: M3; Thread pitch: 0,5; Supplier 1: TME; Supplier Part Number 1: FIX-MAE-5TV; Category: Plastic Pegs; Weight: 0.145; Multiples: 10; Material: polyamide; Spacer length: 5mm; Price Type: NET
MECH19-MECH21 = STANDOFF_M-F_THREADED_M3x8x10mm_HEX_5mm dia: STANDOFF M/F MET 5MM HEX 10MM L; Manufacturer: BOSSARD; Manufacturer Part Number 1: M30012.00.65; Part Description: Screwed spacer sleeve; 12mm; Int.thread: M3; brass; nickel; Supplier 1: TME; Supplier Part Number 1: TDYSFF-M3/12
MECH22-MECH27 = STANDOFF_M-F_THREADED_M3x8x10mm_HEX_5mm dia: STANDOFF M/F MET 5MM HEX 10MM L; Manufacturer: BOSSARD; Manufacturer Part Number 1: 1003755; Part Description: Screw; M3x6; DIN:912; Head: cheese head; imbus; steel; zinc; Supplier 1: TME; Supplier Part Number 1: 1003755
R232 R233 = Res_0402: Manufacturer Part Number 1: CRCW08050000Z0EA; Manufacturer: Vishay Dale; Part Description: RES SMD 0.0 OHM JUMPER 1/8W 0805; Power (Watts): 0.125W, 1/8W; Resistance (Ohms): 0.0; Tolerance: Jumper; Value: 0R; Supplier 1: Digi-Key; Supplier Part Number 1: 541-0.0ATR-ND; Package / Case: 0805 (2012 Metric); Height: 0.020" (0.50mm); Packaging: Tape & Reel (TR); Operating Temperature: -55°C ~ 155°C; Temperature Coefficient: -; RoHS: RoHS Compliant; Size / Dimension: 0.079" L x 0.049" W (2.00mm x 1.25mm); Supplier Device Package: 0805 (2012 Metric); Number of Terminations: 2; Category: Resistors; Features: Automotive AEC-Q200; Composition: Thick Film
R234 = Res_0402: Manufacturer: Yageo; Manufacturer Part Number 1: RC0402FR-0710KL; Part Description: RES SMD 10K OHM 1% 1/16W 0402; Temperature Coefficient: ±100ppm/°C; Power (Watts): 0.063W, 1/16W; Value: 10k, 1%; Supplier 1: Digi-Key; Supplier Part Number 1: 311-10.0KLRTR-ND; Resistance (Ohms): 10k; Packaging: Tape & Reel (TR); RoHS: RoHS Compliant; Package / Case: 0402 (1005 Metric); Tolerance: ±1%; Operating Temperature: -55°C ~ 155°C; Size / Dimension: 0.039" L x 0.020" W (1.00mm x 0.50mm); Number of Terminations: 2; Category: Resistors; Height: 0.016" (0.40mm); Supplier Device Package: 0402; Features: Moisture Resistant; Composition: Thick Film
R235 R238 R240 R245 = Res_0402: Manufacturer Part Number 1: ERJ-2RKF4422X; Manufacturer: Panasonic Electronic Components; Part Description: RES SMD 44.2K OHM 1% 1/10W 0402; Power (Watts): 0.1W, 1/10W; Temperature Coefficient: ±100ppm/°C; Value: 44.2k, 1%; Supplier 1: Digi-Key; Supplier Part Number 1: P44.2KLCT-ND; Tolerance: ±1%; Supplier Device Package: 0402; Packaging: Cut Tape (CT); Size / Dimension: 0.039" L x 0.020" W (1.00mm x 0.50mm); Features: Automotive AEC-Q200; Package / Case: 0402 (1005 Metric); Height: 0.016" (0.40mm); Operating Temperature: -55°C ~ 155°C; Number of Terminations: 2; Composition: Thick Film; Resistance (Ohms): 44.2k; RoHS: RoHS Compliant; Category: Resistors
R236 R241 = Res_0402: Manufacturer: Vishay Dale; Part Description: RES SMD 100K OHM 1% 1/10W 0402; Manufacturer Part Number 1: ERJ-2GEJ104X; Manufacturer Part Number: CRCW0402100KFKEDC; Power (Watts): 0.063W, 1/16W; Temperature Coefficient: ±100ppm/°C; Value: 100k, 1%; Supplier 1: Digi-Key; Supplier Part Number 1: 541-3960-1-ND; Category: Resistors; Size / Dimension: 0.039" L x 0.020" W (1.00mm x 0.50mm); Supplier Device Package: 0402; Composition: Thick Film; Number of Terminations: 2; RoHS: RoHS Compliant; Height: 0.016" (0.40mm); Operating Temperature: -55°C ~ 155°C; Features: Automotive AEC-Q200; Tolerance: ±1%; Packaging: Cut Tape (CT); Resistance (Ohms): 100k; Package / Case: 0402 (1005 Metric); Failure Rate: -; Height - Seated (Max): 0.014" (0.35mm); Part Status: Active
R237 = Res_0402: Manufacturer: Stackpole Electronics Inc.; Manufacturer Part Number 1: RMCF0402FT2K21; Part Description: RES SMD 2.21K OHM 1% 1/16W 0402; Power (Watts): 0.063W, 1/16W; Temperature Coefficient: ±100ppm/°C; Value: 2.21k, 1%; Supplier 1: Digi-Key; Supplier Part Number 1: RMCF0402FT2K21CT-ND; Operating Temperature: -55°C ~ 155°C; Height: 0.016" (0.40mm); Tolerance: ±1%; Resistance (Ohms): 2.21k; Features: Automotive AEC-Q200; Package / Case: 0402 (1005 Metric); Packaging: Cut Tape (CT); Composition: Thick Film; Category: Resistors; Supplier Device Package: 0402; Number of Terminations: 2; RoHS: RoHS Compliant; Size / Dimension: 0.039" L x 0.020" W (1.00mm x 0.50mm)
R239 = Res_0402: Manufacturer: Yageo; Part Description: RES SMD 22K OHM 1% 1/16W 0402; Manufacturer Part Number 1: RC0402FR-0722KL; Temperature Coefficient: ±100ppm/°C; Power (Watts): 0.063W, 1/16W; Value: 22k, 1%; Number of Terminations: 2; Operating Temperature: -55°C ~ 155°C; Package / Case: 0402 (1005 Metric); Category: Resistors; Size / Dimension: 0.039" L x 0.020" W (1.00mm x 0.50mm); Height: 0.016" (0.40mm); Supplier 1: Digi-Key; Supplier Part Number 1: 311-22.0KLRCT-ND; RoHS: RoHS Compliant; Features: Moisture Resistant; Packaging: Cut Tape (CT); Composition: Thick Film; Supplier Device Package: 0402; Resistance (Ohms): 22k; Tolerance: ±1%
R242 R243 = Res_0402: Manufacturer: Yageo; Manufacturer Part Number 1: RC0805FR-07100RL; Part Description: 100 Ohms ±1% 0.125W, 1/8W Chip Resistor 0805 (2012 Metric) Moisture Resistant Thick Film; Power Rating: 125mW; Voltage Rating: 150V; Temperature Coefficient: 100ppm/°C; Application(s): HIGH RELIABILITY; Value: 100R, 1%; Supplier 1: Digi-Key; Supplier Part Number 1: 311-100CRCT-ND; Stock 1: 3385227; Pricing 1: 1=0,10000, 10=0,03800, 100=0,01560, 1000=0,00699, 2500=0,00607 (USD); RoHS: Yes; Case/Package: 0805; Number of Pins: 2; Case Code (Imperial): 0805; Case Code (Metric): 2012; Weight: 0.000917oz; Min Operating Temperature: -55°C; Max Operating Temperature: 155°C; Resistance: 100R; Tolerance: 1%; Packaging: Cut Tape; Package Quantity: 5000; Termination: SMD/SMT; Resistor Type: Thick Film; Number of Terminations: 2; Max Power Dissipation: 125mW; Features: Moisture Resistant; Series: RC; Technology: THICK FILM; Voltage Rating (DC): 150V; Type: General Purpose; Length: 2mm; Width: 1.25mm; Height: 0.5mm; Depth: 1.25mm; Lead Pitch: 0.4mm; REACH SVHC: Unknown; Lead Free: Lead Free; RoHS Compliant: Yes; Military Standard: Not
R244 = Res_0402: Manufacturer: Vishay Dale; Part Description: RES SMD 3K OHM 1% 1/16W 0402; Manufacturer Part Number 1: CRCW04023K00FKED; Temperature Coefficient: ±100ppm/°C; Power (Watts): 0.063W, 1/16W; Value: 3k, 1%; Category: Resistors; Tolerance: ±1%; RoHS: RoHS Compliant; Composition: Thick Film; Number of Terminations: 2; Operating Temperature: -55°C ~ 155°C; Supplier Device Package: 0402 (1005 Metric); Supplier Part Number 1: 541-3.00KLCT-ND; Packaging: Cut Tape (CT); Supplier 1: Digi-Key; Package / Case: 0402 (1005 Metric); Features: Automotive AEC-Q200; Resistance (Ohms): 3k; Height: 0.016" (0.40mm); Size / Dimension: 0.039" L x 0.020" W (1.00mm x 0.50mm)
R246 = Res_0402: Manufacturer Part Number 1: RC0402FR-071K6L; Manufacturer: Yageo; Part Description: 1.6 kOhms ±1% 0.063W, 1/16W Chip Resistor 0402 (1005 Metric) Moisture Resistant Thick Film; Temperature Coefficient: ±100ppm/°C; Power (Watts): 0.063W, 1/16W; Value: 1.6k, 1%; Tolerance: ±1%; RoHS: RoHS Compliant; Package / Case: 0402 (1005 Metric); Height - Seated (Max): 0.016" (0.40mm); Supplier Device Package: 0402; Failure Rate: -; Composition: Thick Film; Part Status: Active; Size / Dimension: 0.039" L x 0.020" W (1.00mm x 0.50mm); Operating Temperature: -55°C ~ 155°C; Packaging: Cut Tape (CT); Features: Moisture Resistant; Supplier Part Number 1: YAG3045CT-ND; Category: Resistors; Supplier 1: Digi-Key
R247 = Res_0402: Manufacturer Part Number 1: RC0402FR-07510RL; Manufacturer: Yageo; Part Description: 510 Ohms ±1% 0.063W, 1/16W Chip Resistor 0402 (1005 Metric) Moisture Resistant Thick Film; Temperature Coefficient: ±100ppm/°C; Power (Watts): 0.063W, 1/16W; Value: 510R, 1%; Operating Temperature: -55°C ~ 155°C; Part Status: Active; Tolerance: ±1%; Packaging: Cut Tape (CT); Features: Moisture Resistant; Composition: Thick Film; Supplier Device Package: 0402; Failure Rate: -; Package / Case: 0402 (1005 Metric); Height - Seated (Max): 0.016" (0.40mm); Size / Dimension: 0.039" L x 0.020" W (1.00mm x 0.50mm); Supplier 1: Digi-Key; RoHS: RoHS Compliant; Category: Resistors; Supplier Part Number 1: 311-510LRCT-ND
R248 = Res_0402: Manufacturer 1: Yageo; Manufacturer Part Number 1: RC0402FR-071K2L; Part Description: 1.2 kOhms ±1% 0.063W, 1/16W Chip Resistor 0402 (1005 Metric) Moisture Resistant Thick Film; Resistance: 1.2kR; Power Rating: 63mW; Voltage Rating: 50V; Temperature Coefficient: 100ppm/°C; Value: 1.2k, 1%; Supplier 1: Digi-Key; Supplier Part Number 1: 311-1.20KLRCT-ND; Stock 1: 1348237; Pricing 1: 1=0,10000, 10=0,01500, 100=0,00610, 1000=0,00275, 2500=0,00239, 5000=0,00197 (USD); RoHS: Yes; Case/Package: 0402; Case Code (Imperial): 0402; Case Code (Metric): 1005; Size Code: 0402; Min Operating Temperature: -55°C; Max Operating Temperature: 155°C; Tolerance: 1%; Packaging: Tape and Reel; Package Quantity: 1; Termination: SMD/SMT; Resistor Type: Thick Film; Number of Terminations: 2; Max Power Dissipation: 63mW; Features: Moisture Resistant; Series: RC; Construction: Rectangular; Resistance Tolerance: 1%; Technology: THICK FILM; Length: 1mm; Width: 0.02inch; Height: 0.016inch; Depth: 0.5mm; REACH SVHC: Unknown; Military Standard: Not; Lead Free: Lead Free; RoHS Compliant: Yes; ComponentLink1URL: https://datasheet.ciiva.com/11808/0900766b80c66297-11808455.pdf?src-supplier=RSComponents; ComponentLink1Description: https://datasheet.ciiva.com/11808/0900766b80c66297-11808455.pdf?src-supplier=RSComponents; ComponentLink2URL: https://datasheet.ciiva.com/2453/pyu-r-int-thick-7-2453467.pdf?src-supplier=Digi-Key; ComponentLink2Description: https://datasheet.ciiva.com/2453/pyu-r-int-thick-7-2453467.pdf?src-supplier=Digi-Key; ComponentLink3URL: https://datasheet.ciiva.com/2453/pyu-r-int-thick-7-2453468.pdf?src-supplier=Digi-Key; ComponentLink3Description: https://datasheet.ciiva.com/2453/pyu-r-int-thick-7-2453468.pdf?src-supplier=Digi-Key; ComponentLink4URL: https://datasheet.ciiva.com/2453/pyu-r-int-thick-7-2453466.pdf?src-supplier=Digi-Key; ComponentLink4Description: https://datasheet.ciiva.com/2453/pyu-r-int-thick-7-2453466.pdf?src-supplier=Digi-Key; ComponentLink5URL: https://datasheet.ciiva.com/7849/1018594-7849861.pdf?src-supplier=Element14; ComponentLink5Description: https://datasheet.ciiva.com/7849/1018594-7849861.pdf?src-supplier=Element14; ComponentLink6URL: https://datasheet.ciiva.com/7849/1018594-7849862.pdf?src-supplier=Element14; ComponentLink6Description: https://datasheet.ciiva.com/7849/1018594-7849862.pdf?src-supplier=Element14; ComponentLink7URL: https://datasheet.ciiva.com/15189/getdatasheetpartid-323716-15189366.pdf?src-supplier=Verical; ComponentLink7Description: https://datasheet.ciiva.com/15189/getdatasheetpartid-323716-15189366.pdf?src-supplier=Verical; ComponentLink8URL: https://datasheet.ciiva.com/16745/pyu-rc0402-51-rohs-l-6-r-16745005.pdf?src-supplier=Future+Electronics; ComponentLink8Description: https://datasheet.ciiva.com/16745/pyu-rc0402-51-rohs-l-6-r-16745005.pdf?src-supplier=Future+Electronics
R249 = Res_0402: Manufacturer: Stackpole Electronics Inc; Manufacturer Part Number 1: RMCF0402FT1K00; Part Description: RES SMD 1K OHM 1% 1/16W 0402; Temperature Coefficient: ±100ppm/°C; Power (Watts): 0.063W, 1/16W; Value: 1k, 1%; Supplier 1: Digi-Key; Supplier Part Number 1: RMCF0402FT1K00TR-ND; Resistance (Ohms): 1k; Packaging: Tape & Reel (TR); Category: Resistors; RoHS: RoHS Compliant; Tolerance: ±1%; Height: 0.016" (0.40mm); Number of Terminations: 2; Package / Case: 0402 (1005 Metric); Operating Temperature: -55°C ~ 155°C; Features: -; Composition: Thick Film; Supplier Device Package: 0402; Size / Dimension: 0.039" L x 0.020" W (1.00mm x 0.50mm)
TP3-TP5 TP10 = TESTPOINT_PAD: Test Point PCB mount Miniature White
TP6-TP9 = TESTPOINT_THT_MINI: Test Point PCB mount Miniature White; Manufacturer Part Number 1: S1751-46R; Manufacturer: Harwin Inc; Part Description: Natural PC Test Point 0.128" x 0.065" x 0.079" (3.25mm x 1.65mm x 2.00mm) Brass, Tin Plating Surface Mount Mounting Type; Supplier 1: Digi-Key; Supplier Part Number 1: 952-1478-2-ND; RoHS: RoHS Compliant; Color: Natural; Material: Copper Alloy; Mounting Type: Surface Mount; Terminal: 0.128" x 0.065" x 0.079" (3.25mm x 1.65mm x 2.00mm) Brass, Tin Plated; Type: PC Test Point; Packaging: Tape & Reel (TR); Category: Test and Measurement
VD18-VD20 VD22 = DIODE_SCHOTTKY_SOD-523F: Diode Schottky SMD SOD-523F; Manufacturer Part Number 1: SK36A-LTP; Manufacturer: Micro Commercial Co; Part Description: DIODE SCHOTTKY 60V 3A DO214AC; Current - Reverse Leakage @ Vr: 500µA @ 60V; Speed: Fast Recovery =< 500ns, > 200mA (Io); Voltage - DC Reverse (Vr) (Max): 60V; Capacitance @ Vr, F: 250pF @ 4V, 1MHz; Voltage - Forward (Vf) (Max) @ If: 750mV @ 3A; Current - Average Rectified (Io): 3A; Supplier 1: Digi-Key; Supplier Part Number 1: SK36A-LTPMSCT-ND; Package / Case: DO-214AC, SMA; Reverse Recovery Time (trr): -; Diode Type: Schottky; Category: Discrete Semiconductor Products; Mounting Type: Surface Mount; RoHS: RoHS Compliant; Packaging: Cut Tape (CT); Operating Temperature - Junction: -50°C ~ 125°C; Supplier Device Package: DO-214AC (SMA)
VD21 = DIODE_TVS_UNIDIR: SMAJ12CA-13-F; Manufacturer: Taiwan Semiconductor; Part Description: 23.2V Clamp 25.9A Ipp Tvs Diode Surface Mount DO-214AA (SMB); Operating Supply Voltage: 14V; Max Surge Current: 100A; Breakdown Voltage: 15.6V; Number of Channels: 1; Clamping Voltage: 23.2V; Peak Pulse Power: 600W; Polarity: Unidirectional; ComponentLink1URL: http://www.farnell.com/datasheets/2358777.pdf?src-supplier=Farnell; ComponentLink1Description: http://www.farnell.com/datasheets/2358777.pdf?src-supplier=Farnell; ComponentLink2URL: http://www.mouser.com/ds/2/395/SMBJ%20SERIES-231843.pdf?src-supplier=Mouser; ComponentLink2Description: http://www.mouser.com/ds/2/395/SMBJ%20SERIES-231843.pdf?src-supplier=Mouser; ComponentLink3URL: http://www.farnell.com/datasheets/2358777.pdf?src-supplier=Element14; ComponentLink3Description: http://www.farnell.com/datasheets/2358777.pdf?src-supplier=Element14; Supplier 1: Digi-Key; Supplier Part Number 1: SMBJ14AFSCT-ND; Manufacturer Part Number 1: SMBJ14A; Stock 1: 17494; Pricing 1: 1=0,54000, 10=0,46400, 100=0,34630, 500=0,27212, 1000=0,21028 (USD); RoHS: Yes; Case/Package: DO-214AA; Number of Pins: 2; Min Operating Temperature: -65°C; Max Operating Temperature: 150°C; Packaging: Tape and Reel; Package Quantity: 3000; Voltage Rating (DC): 14V; Power Rating: 600W; Length: 5.59mm; Width: 3.94mm; Height: 2.44mm; Lead Free: Lead Free; RoHS Compliant: Yes; Value: SMBJ14A